# Altium schematic sheet Micphone.SchDoc
size A
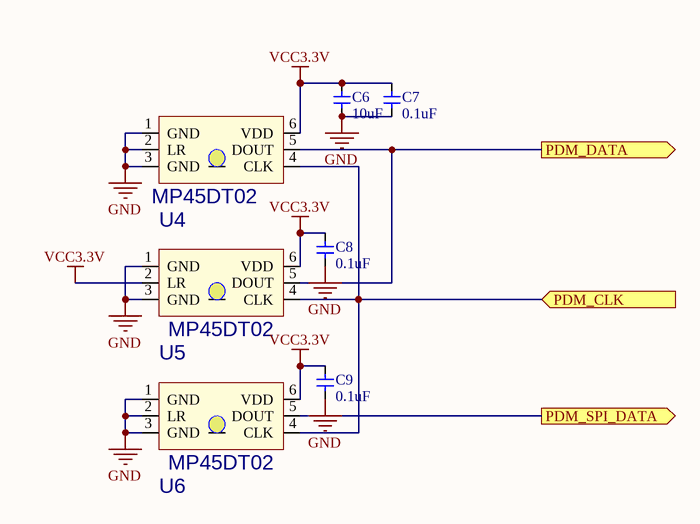
[diagram p0: Micphone.SchDoc]

## Parts
C6  value 10uF  [CAP_0603]  (hidden comment: Cap_0603)
C7  value 0.1uF  [CAP_0603]  (hidden comment: Cap_0603)
C8  value 0.1uF  [CAP_0603]  (hidden comment: Cap_0603)
C9  value 0.1uF  [CAP_0603]  (hidden comment: Cap_0603)
U4  MP45DT02  [ST_HLGA6]
U5  MP45DT02  [ST_HLGA6]
U6  MP45DT02  [ST_HLGA6]

## Ports
PDM_CLK (in), PDM_DATA (out), PDM_SPI_DATA (out)

## Nets
GND: C6.1 C7.1 C8.1 C9.1 U4.1(GND) U4.2(LR) U4.3(GND) U5.1(GND) U5.3(GND) U6.1(GND) U6.2(LR) U6.3(GND)
VCC3.3V: C6.2 C7.2 C8.2 C9.2 U4.6(VDD) U5.2(LR) U5.6(VDD) U6.6(VDD)
PDM_CLK: U4.4(CLK) U5.4(CLK) U6.4(CLK) ; port PDM_CLK
PDM_DATA: U4.5(DOUT) U5.5(DOUT) ; port PDM_DATA
PDM_SPI_DATA: U6.5(DOUT) ; port PDM_SPI_DATA

## Library data of the parts
C6-C9 = Cap_0603: Capacitor
U4-U6 = MP45DT02: Mic Omni-Directional -26dB 3.6V Rectangular Solder Pad; MF: STMicroelectronics; MP: MP45DT02; Package: None; Availability: Good; Price: 2.57 USD; Value: *